# Altium schematic sheet MyProject.SchDoc
size A; SheetNumber: 1; SheetTotal: 1
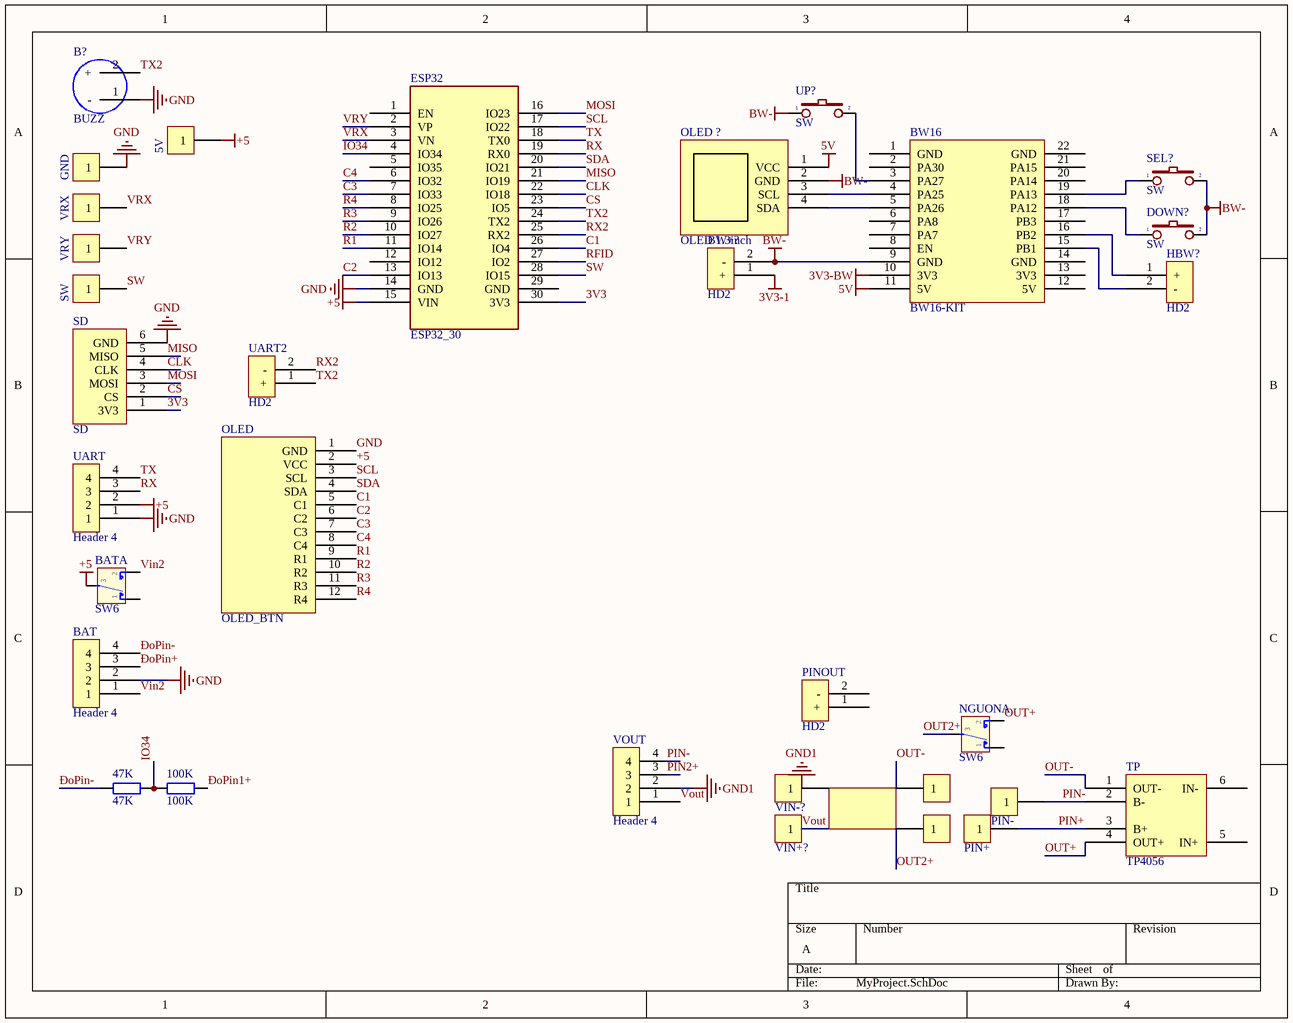
[diagram p0: MyProject.SchDoc]

## Parts
(Parts that share a designator on the sheet are numbered #1, #2 ... from top to bottom, then left to right.)
5V  Header 1  [HEAD1]  (value not drawn)
47K  47K  [R1/4W]
100K  100K  [R1/4W]
B?  BUZZ  [BUZZ]
BAT#1  SW6  [SW6]  (part A of 2)
BAT#2  Header 4  [Header 4]
BW16  BW16-KIT  [BW16-KIT]
BW+?  HD2  [Header 2]
DOWN?  SW  [SW2]
ESP32  ESP32_30  [ESP32_30]
GND  Header 1  [HEAD1]  (value not drawn)
HBW?  HD2  [Header 2]
NGUON  SW6  [SW6]  (part A of 2)
OLED  OLED_BTN  [OLED_BTN]
OLED_?  OLED 1.3inch  [OLED 1.3inch]
OUT+  Header 1  [HEAD1]  (value not drawn)
OUT-  Header 1  [HEAD1]  (value not drawn)
PIN+  Header 1  [HEAD1]  (value not drawn)
PIN-  Header 1  [HEAD1]  (value not drawn)
PINOUT  HD2  [Header 2]
SD  SD  [SD]
SEL?  SW  [SW2]
SW  Header 1  [HEAD1]  (value not drawn)
TP  TP4056  [TP4056]
UART  Header 4  [Header 4]
UART2  HD2  [Header 2]
UP?  SW  [SW2]
VIN+?  Header 1  [HEAD1]  (value not drawn)
VIN-?  Header 1  [HEAD1]  (value not drawn)
VOUT  Header 4  [Header 4]
VRX  Header 1  [HEAD1]  (value not drawn)
VRY  Header 1  [HEAD1]  (value not drawn)

## Nets
3V3-1: BW+?.1(+)
3V3-BW: BW16.10(3V3)
5V: BW16.11(5V) OLED_?.1(VCC)
+5: 5V.1 BAT#1.3 ESP32.15(VIN) OLED.2(VCC) UART.2
BW-: BW16.9(GND) BW+?.2(-) DOWN?.2 OLED_?.2(GND) SEL?.2 UP?.1
GND: B?.1(-) BAT#2.2 ESP32.14(GND) GND.1 OLED.1(GND) SD.6(GND) UART.1
GND1: VOUT.2
3V3: ESP32.30(3V3) SD.1(3V3)
C1: ESP32.26(IO4) OLED.5(C1)
C2: ESP32.13(IO13) OLED.6(C2)
C3: ESP32.7(IO33) OLED.7(C3)
C4: ESP32.6(IO32) OLED.8(C4)
CLK: ESP32.22(IO18) SD.4(CLK)
CS: ESP32.23(IO5) SD.2(CS)
IO34: 47K.2 100K.1 ESP32.4(IO34)
MISO: ESP32.21(IO19) SD.5(MISO)
MOSI: ESP32.16(IO23) SD.3(MOSI)
OUT2+: NGUON.3 OUT+.1
OUT+: NGUON.2 TP.4(OUT+)
OUT-: OUT-.1 TP.1(OUT-)
PIN2+: VOUT.3
PIN+: PIN+.1 TP.3(B+)
PIN-: PIN-.1 TP.2(B-) VOUT.4
R1: ESP32.11(IO14) OLED.9(R1)
R2: ESP32.10(IO27) OLED.10(R2)
R3: ESP32.9(IO26) OLED.11(R3)
R4: ESP32.8(IO25) OLED.12(R4)
RFID: ESP32.27(IO2)
RX: ESP32.19(RX0) UART.3
RX2: ESP32.25(RX2) UART2.2(-)
SCL: ESP32.17(IO22) OLED.3(SCL)
SDA: ESP32.20(IO21) OLED.4(SDA)
SW: ESP32.28(IO15) SW.1
TX: ESP32.18(TX0) UART.4
TX2: B?.2(+) ESP32.24(TX2) UART2.1(+)
Vin2: BAT#1.2 BAT#2.1
Vout: VIN+?.1 VOUT.1
VRX: ESP32.3(VN) VRX.1
VRY: ESP32.2(VP) VRY.1
ĐoPin1+: 100K.2
ĐoPin+: BAT#2.3
ĐoPin-: 47K.1 BAT#2.4
NetBW16_3: BW16.3(PA27) UP?.2
NetBW16_4: BW16.4(PA25) OLED_?.3(SCL)
NetBW16_5: BW16.5(PA26) OLED_?.4(SDA)
NetBW16_15: BW16.15(PB1) HBW?.2(-)
NetBW16_16: BW16.16(PB2) HBW?.1(+)
NetBW16_18: BW16.18(PA12) DOWN?.1
NetBW16_19: BW16.19(PA13) SEL?.1

Not connected (* = marked no-connect by the designer): BAT#1 1; BW16 1(GND) 2(PA30) 6(PA8) 7(PA7) 8(EN) 12(5V) 13(3V3) 14(GND) 17(PB3) 20(PA14) 21(PA15) 22(GND); ESP32 1(EN) 5(IO35) 12(IO12) 29(GND); NGUON 1; PINOUT 1(+) 2(-); TP 5(IN+) 6(IN-); VIN-? 1

## Notes on the sheet
- Labels drawn without touching a wire or pin: GND1

## Library data of the parts
5V GND OUT+ OUT- PIN+ PIN- SW VIN+? VIN-? VRX VRY = Header 1: Header, 1-Pin, Right Angle; Revised: Zion Blue; Published: 6-May-2014; Publisher: Cynetik Group
47K 100K = R1/4W: Resistor 1/4W; Value: R1/4W - 1K
BAT#1 NGUON = SW6: SW-DTDP - 6 Pin; Value: SW6
BW+? HBW? PINOUT UART2 = Header 2
DOWN? SEL? UP? = SW2: Switch button 2 pin; Value: SW chip 2 pin
ESP32 = ESP32_30: Microcontoller Board 30 Pins Wifi 2.4GHz BLE 4.2 ESP32-WROOM-32D; ComponentLink1Description: Datasheet; ComponentLink1URL: https://www.mouser.com/datasheet/2/891/esp32_wroom_32d_esp32_wroom_32u_datasheet_en-1365844.pdf